# EAGLE design heart_eyes (EAGLE 9.5.2)
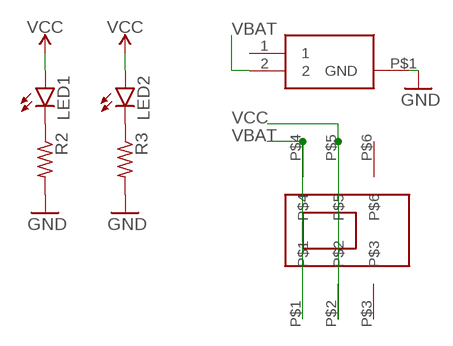
[diagram p0: schematic, sheet 1]

## Parts
LED1  LEDCHIP-LED0805  [CHIP-LED0805]
LED2  LEDCHIP-LED0805  [CHIP-LED0805]
R2  R-US_R0603  [R0603]
R3  R-US_R0603  [R0603]
U$1  CL-SB-22A-02T-SLIDE-SWITCH-TUCKED-PADS  [CL-SB-22A-02T-DPDT-COMPACT-SWITCH]
VBAT  BAT-HLD-012-SMT  [BATHLD012SMT]

## Nets
GND: R2.2 R3.2 VBAT.P$1(GND)
N$1: LED1.C R2.1
N$3: LED2.C R3.1
VBAT: U$1.P$1 U$1.P$4 VBAT.2
VCC: LED1.A LED2.A U$1.P$2 U$1.P$5
Unconnected: U$1.P$3 U$1.P$6 VBAT.1

## Library data of the parts
LED1 LED2 = led:LED: LED OSRAM: - CHIPLED LG R971, LG N971, LY N971, LG Q971, LY Q971, LO R971, LY R971 LH N974, LH R974 LS Q976, LO Q976, LY Q976 LO Q996 - Hyper CHIPLED LW Q18S LB Q993, LB Q99A, LB R99A - SideLED LS A670, LO A670, LY A670, LG A670, LP A670 LB A673, LV A673, LT A673, LW A673 LH A674 LY A675 LS A676, LA A676, LO A676, LY A676, LW A676 LS A679, LY A679, LG A679 - Hyper Micro SIDELED® LS Y876, LA Y876, LO Y876, LY Y876 LT Y87S - SmartLED LW L88C, LW L88S LB L89C, LB L89S, LG L890 LS L89K, LO L89K, LY L89K LS L896, LA L896, LO L896, LY L896 - TOPLED LS T670, LO T670, LY T670, LG T670, LP T670 LSG T670, LSP T670, LSY T670, LOP T670, LYG T670 LG T671, LOG T671, LSG T671 LB T673, LV T673, LT T673, LW T673 LH T674 LS T676, LA T676, LO T676, LY T676, LB T676, LH T676, LSB T676, LW T676 LB T67C, LV T67C, LT T67C, LS T67K, LO T67K, LY T67K, LW E67C LS E67B, LA E67B, LO E67B, LY E67B, LB E67C, LV E67C, LT E67C LW T67C LS T679, LY T679, LG T679 LS T770, LO T770, LY T770, LG T770, LP T770 LB T773, LV T773, LT T773, LW T773 LH T774 LS E675, LA E675, LY E675, LS T675 LS T776, LA T776, LO T776, LY T776, LB T776 LHGB T686 LT T68C, LB T68C - Hyper Mini TOPLED® LB M676 - Mini TOPLED Santana® LG M470 LS M47K, LO M47K, LY M47K Source: http://www.osram.convergy.de LUXEON: - LUMILED® LXK2-PW12-R00, LXK2-PW12-S00, LXK2-PW14-U00, LXK2-PW14-V00 LXK2-PM12-R00, LXK2-PM12-S00, LXK2-PM14-U00 LXK2-PE12-Q00, LXK2-PE12-R00, LXK2-PE12-S00, LXK2-PE14-T00, LXK2-PE14-U00 LXK2-PB12-K00, LXK2-PB12-L00, LXK2-PB12-M00, LXK2-PB14-N00, LXK2-PB14-P00, LXK2-PB14-Q00 LXK2-PR12-L00, LXK2-PR12-M00, LXK2-PR14-Q00, LXK2-PR14-R00 LXK2-PD12-Q00, LXK2-PD12-R00, LXK2-PD12-S00 LXK2-PH12-R00, LXK2-PH12-S00 LXK2-PL12-P00, LXK2-PL12-Q00, LXK2-PL12-R00 Source: www.luxeon.com KINGBRIGHT: KA-3528ASYC Source: www.kingbright.com
R2 R3 = rcl:R-US_: RESISTOR, American symbol; SPICEPREFIX: R
U$1 = electroninks:CL-SB-22A-02T-SLIDE-SWITCH-TUCKED-PADS
VBAT = SamacSys_Parts:BAT-HLD-012-SMT: Coin Cell Battery Holders Bat Hld CR1216/1225 Surface Mount Source: Datasheet <https://componentsearchengine.com/Datasheets/1/BAT-HLD-012-SMT.pdf>; DESCRIPTION: Coin Cell Battery Holders Bat Hld CR1216/1225 Surface Mount; HEIGHT: 3mm; MANUFACTURER_NAME: Linx Technologies; MANUFACTURER_PART_NUMBER: BAT-HLD-012-SMT; MOUSER_PART_NUMBER: 712-BAT-HLD-012-SMT; MOUSER_PRICE-STOCK: https://www.mouser.com/Search/Refine.aspx?Keyword=712-BAT-HLD-012-SMT

## Board
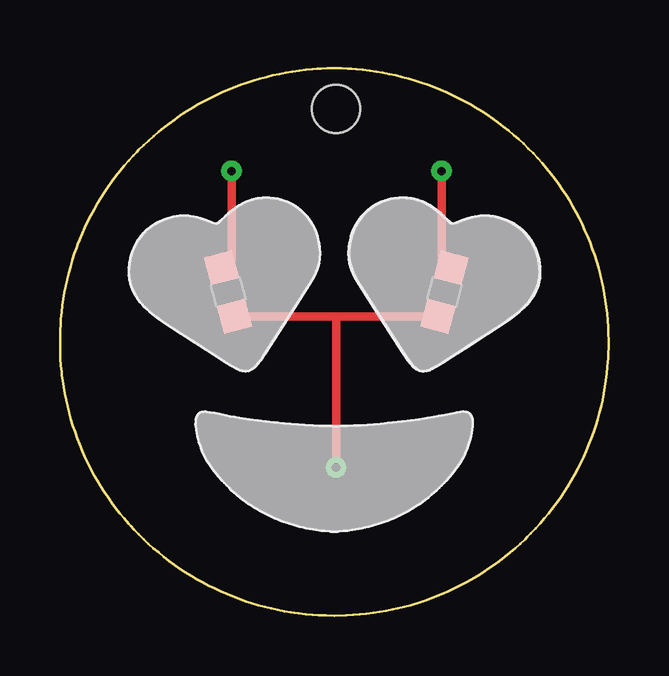
[diagram p1: board, top side]
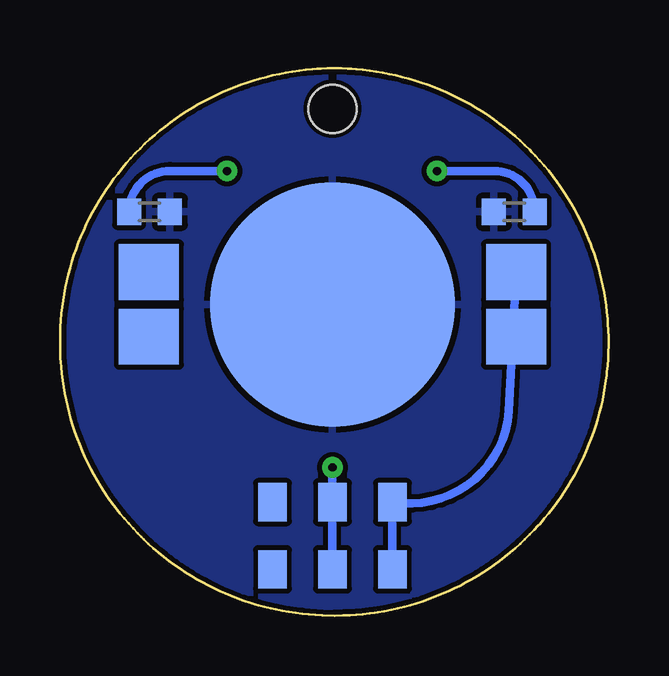
[diagram p2: board, bottom side, seen from below]

Size 22.86 x 22.82 mm. Coordinates in mm from the lower left corner, seen from the top.
Outline: 11.42,22.82 11.14,22.81 10.86,22.8 10.72,22.79 10.51,22.78 10.24,22.75 9.96,22.72 9.69,22.68 9.41,22.63 9.14,22.58 8.87,22.52 8.6,22.46 8.33,22.39 8.06,22.31 7.8,22.22 7.53,22.13 7.27,22.03 7.01,21.93 6.76,21.82 6.51,21.7 6.26,21.58 6.01,21.45 5.77,21.32 5.53,21.18 5.29,21.03 5.12,20.92 5,20.84 4.77,20.68 4.55,20.52 4.33,20.35 4.11,20.18 3.9,20 3.69,19.81 3.49,19.62 3.29,19.43 3.19,19.33 3.05,19.17 2.86,18.97 2.68,18.76 2.5,18.54 2.33,18.33 2.16,18.1 2,17.88 1.85,17.65 1.7,17.41 1.56,17.17 1.42,16.93 1.29,16.69 1.16,16.44 1.04,16.19 0.93,15.93 0.82,15.68 0.74,15.48 0.7,15.35 0.6,15.09 0.52,14.83 0.44,14.56 0.36,14.29 0.3,14.02 0.24,13.75 0.19,13.48 0.14,13.2 0.1,12.93 0.07,12.65 0.04,12.37 0.02,12.17 0.01,11.89 0,11.61 0,11.47 0,11.26 0.01,10.99 0.02,10.71 0.04,10.43 0.07,10.15 0.08,10.02 0.11,9.81 0.15,9.53 0.2,9.26 0.25,8.99 0.31,8.72 0.38,8.45 0.46,8.18 0.54,7.91 0.63,7.65 0.72,7.39 0.82,7.13 0.93,6.87 1.04,6.62 1.16,6.37 1.28,6.12 1.42,5.87 1.55,5.63 1.7,5.39 1.85,5.16 2,4.93 2.16,4.7 2.33,4.48 2.5,4.26 2.68,4.04 2.86,3.83 2.95,3.73 3.09,3.58 3.29,3.38 3.48,3.18 3.69,2.99 3.89,2.81 4.1,2.63 4.32,2.45 4.54,2.28 4.76,2.12 4.99,1.96 5.23,1.8 5.46,1.66 5.7,1.52 5.94,1.38 6.19,1.25 6.44,1.13 6.69,1.01 6.94,0.9 7.2,0.79 7.46,0.69 7.72,0.6 7.99,0.52 8.26,0.44 8.52,0.36 8.79,0.3 9.07,0.24 9.34,0.18 9.61,0.14 9.75,0.12 9.96,0.09 10.23,0.06 10.51,0.03 10.79,0.02 11.07,0 11.42,0 11.93,0.01 12.21,0.02 12.49,0.05 12.77,0.07 13.04,0.11 13.32,0.15 13.59,0.2 13.86,0.25 14.07,0.3 14.34,0.36 14.61,0.44 14.74,0.48 14.94,0.54 15.2,0.62 15.46,0.72 15.72,0.82 15.98,0.93 16.17,1.01 16.42,1.13 16.67,1.25 16.92,1.38 17.16,1.52 17.4,1.66 17.63,1.81 17.87,1.96 18.09,2.12 18.32,2.28 18.54,2.45 18.76,2.63 18.97,2.81 19.17,2.99 19.38,3.18 19.48,3.28 19.62,3.43 19.81,3.63 20,3.84 20.18,4.05 20.36,4.26 20.53,4.48 20.7,4.7 20.86,4.93 21.01,5.16 21.16,5.4 21.3,5.63 21.44,5.88 21.57,6.12 21.7,6.37 21.82,6.62 21.93,6.87 22.04,7.13 22.14,7.39 22.23,7.65 22.32,7.92 22.4,8.18 22.48,8.45 22.54,8.72 22.61,8.99 22.66,9.26 22.71,9.54 22.75,9.81 22.78,10.09 22.81,10.36 22.83,10.57 22.84,10.71 22.85,10.92 22.86,11.2 22.86,11.47 22.85,11.75 22.84,12.03 22.82,12.31 22.8,12.58 22.77,12.86 22.73,13.14 22.68,13.41 22.63,13.68 22.57,13.95 22.51,14.23 22.44,14.49 22.36,14.76 22.28,15.03 22.18,15.29 22.09,15.55 21.98,15.81 21.87,16.06 21.76,16.31 21.63,16.56 21.51,16.81 21.37,17.05 21.23,17.29 21.08,17.53 20.93,17.76 20.77,17.99 20.61,18.22 20.44,18.44 20.27,18.65 20.09,18.87 19.9,19.07 19.71,19.28 19.52,19.47 19.32,19.67 19.11,19.86 18.91,20.04 18.69,20.22 18.48,20.39 18.25,20.56 18.03,20.72 17.8,20.88 17.57,21.03 17.33,21.18 17.09,21.32 16.85,21.45 16.6,21.58 16.35,21.7 16.1,21.82 15.84,21.93 15.58,22.03 15.32,22.13 15.06,22.22 14.8,22.31 14.53,22.39 14.26,22.46 13.99,22.52 13.72,22.58 13.45,22.63 13.17,22.68 12.9,22.72 12.62,22.75 12.34,22.78 12.14,22.79 12,22.8 11.72,22.81 11.42,22.82
Copper layers (1*16): Top 0.035mm / dielectric 1.5mm / Bottom 0.035mm
Design rules "SparkFun *": minimum track width 8mil, minimum drill 20mil, track to track 8mil, track to pad 8mil, pad to pad 8mil, via to via 8mil, smd to smd 8mil, copper to edge 8mil, drill to drill 8mil, minimum pad ring 12mil, minimum via ring 10mil, stop-mask expansion 4mil, vias tented up to drill 0.4mm, thermal gap 10mil
Holes 2 mm at 11.5,21.13

### Footprints (pad centres in the part's own frame; a part is rotated, then mirrored left to right if it is on the bottom)
CHIP-LED0805 = smd 1.2 x 1.2: A 0,-1.05; C 0,1.05
R0603 = smd 1 x 1.1: 1 -0.85,0; 2 0.85,0
CL-SB-22A-02T-DPDT-COMPACT-SWITCH = smd 1.2 x 1.6: P$1 -2.5,-1.4; P$2 0,-1.4; P$3 2.5,-1.4; P$4 -2.5,1.4; P$5 0,1.4; P$6 2.5,1.4
BATHLD012SMT = smd 2.5 x 2.325: 1 -7.65,1.35; 2 7.65,1.35; P$2 -7.65,-1.35; P$3 7.65,-1.35 | smd 10.2 x 10.2: P$1 0,0

### Placement (x,y rotation side)
LED1  7,13.49 15 top
LED2  16.03,13.49 345 top
R2  3.93,16.83 180 bottom
R3  19.13,16.83 0 bottom
U$1  11.5,3.33 180 bottom
VBAT  11.5,12.97 0 bottom

### Tracks (layer width: path | path; a pad name or v marks a point on that pad's centre or on a via)
GND
  pour Bottom: -0.24,23.63 23.2,23.63 23.2,-1.47 -0.24,-1.47
N$1  (via drill 0.35 pad 0.8)
  Top 0.35: LED1.C arc90 7.15,14.93 v7.15,18.53
  Bottom 0.35: R2.1 arc-90 4.77,18.53 v7.15,18.53
N$3  (via drill 0.35 pad 0.8)
  Top 0.35: LED2.C arc-90 15.9,14.91 v15.9,18.53
  Bottom 0.35: R3.1 arc90 18.28,18.53 v15.9,18.53
VBAT
  Bottom 0.35: VBAT.2 4.15,8.53 arc96 U$1.P$1 U$1.P$4
VCC  (via drill 0.35 pad 0.8)
  Top 0.35: LED1.A 11.5,12.48 | LED2.A 11.55,12.48 11.5,12.48 | v11.5,6.18 11.5,12.48
  Bottom 0.203: U$1.P$2 v11.5,6.18
  Bottom 0.35: U$1.P$5 v11.5,6.18